# Altium schematic sheet Mobile_device_sheet3_pin_map.SchDoc
size A4; SheetNumber: 2; SheetTotal: 5
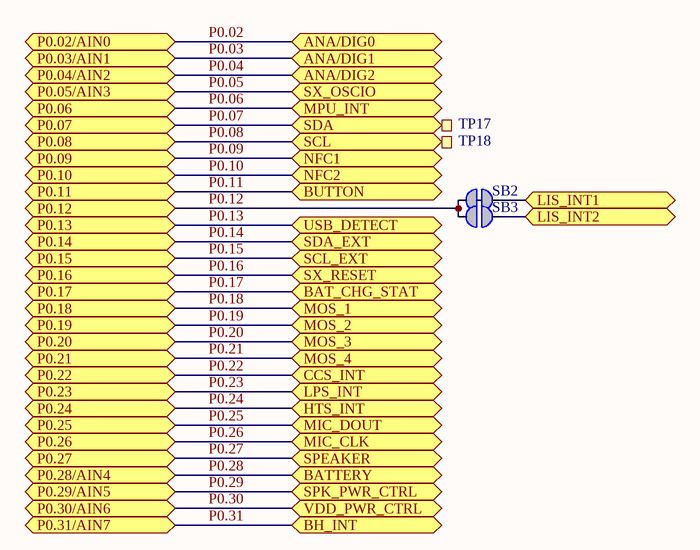
[diagram p0: Mobile_device_sheet3_pin_map.SchDoc]

## Parts
SB2  Solderbridge  [Solderbridge_Shorted]  (value not drawn)  (net tie, no BOM)
SB3  Solderbridge  [Solderbridge]  (value not drawn)  (no BOM)
TP17  Ø1.5mm,SMD  [TP_SMD_Ø1.5mm]  (value not drawn)  (no BOM)
TP18  Ø1.5mm,SMD  [TP_SMD_Ø1.5mm]  (value not drawn)  (no BOM)

## Ports
ANA/DIG0 (bidir), ANA/DIG1 (bidir), ANA/DIG2 (bidir), BAT_CHG_STAT (bidir), BATTERY (bidir), BH_INT (bidir), BUTTON (bidir), CCS_INT (bidir), HTS_INT (bidir), LIS_INT1 (bidir), LIS_INT2 (bidir), LPS_INT (bidir), MIC_CLK (bidir), MIC_DOUT (bidir), MOS_1 (bidir), MOS_2 (bidir), MOS_3 (bidir), MOS_4 (bidir), MPU_INT (bidir), NFC1 (bidir), NFC2 (bidir), P0.02/AIN0 (bidir), P0.03/AIN1 (bidir), P0.04/AIN2 (bidir), P0.05/AIN3 (bidir), P0.06 (bidir), P0.07 (bidir), P0.08 (bidir), P0.09 (bidir), P0.10 (bidir), P0.11 (bidir), P0.12 (bidir), P0.13 (bidir), P0.14 (bidir), P0.15 (bidir), P0.16 (bidir), P0.17 (bidir), P0.18 (bidir), P0.19 (bidir), P0.20 (bidir), P0.21 (bidir), P0.22 (bidir), P0.23 (bidir), P0.24 (bidir), P0.25 (bidir), P0.26 (bidir), P0.27 (bidir), P0.28/AIN4 (bidir), P0.29/AIN5 (bidir), P0.30/AIN6 (bidir), P0.31/AIN7 (bidir), SCL (bidir), SCL_EXT (bidir), SDA (bidir), SDA_EXT (bidir), SPEAKER (bidir), SPK_PWR_CTRL (bidir), SX_OSCIO (bidir), SX_RESET (bidir), USB_DETECT (bidir), VDD_PWR_CTRL (bidir)

## Nets
LIS_INT1: SB2.1 ; port LIS_INT1
LIS_INT2: SB3.1 ; port LIS_INT2
P0.02: port P0.02/AIN0, port ANA/DIG0
P0.03: port P0.03/AIN1, port ANA/DIG1
P0.04: port P0.04/AIN2, port ANA/DIG2
P0.05: port P0.05/AIN3, port SX_OSCIO
P0.06: port MPU_INT, port P0.06
P0.07: TP17.1 ; port SDA, port P0.07
P0.08: TP18.1 ; port SCL, port P0.08
P0.09: port NFC1, port P0.09
P0.10: port NFC2, port P0.10
P0.11: port P0.11, port BUTTON
P0.12: SB2.2 SB3.2 ; port P0.12
P0.13: port P0.13, port USB_DETECT
P0.14: port P0.14, port SDA_EXT
P0.15: port P0.15, port SCL_EXT
P0.16: port P0.16, port SX_RESET
P0.17: port P0.17, port BAT_CHG_STAT
P0.18: port MOS_1, port P0.18
P0.19: port MOS_2, port P0.19
P0.20: port MOS_3, port P0.20
P0.21: port MOS_4, port P0.21
P0.22: port P0.22, port CCS_INT
P0.23: port LPS_INT, port P0.23
P0.24: port P0.24, port HTS_INT
P0.25: port MIC_DOUT, port P0.25
P0.26: port MIC_CLK, port P0.26
P0.27: port SPEAKER, port P0.27
P0.28: port BATTERY, port P0.28/AIN4
P0.29: port P0.29/AIN5, port SPK_PWR_CTRL
P0.30: port P0.30/AIN6, port VDD_PWR_CTRL
P0.31: port P0.31/AIN7, port BH_INT

## Library data of the parts
SB2 = Solderbridge Shorted: Shorted Solderbridge; Artikkelnr Noca: N.A.; Part Number: Solderbridge Shorted; Manufacturer: *; Manufacturer Part Number: *; Footprint Doc: Solderbridge_Shorted; LatestRevisionDate: 2012-08-07; Pin Count: 2; Publisher: Nordic Semiconductor; Published: 2012-08-07; Value: Solderbridge; Note: *; Part number IPS: N.A.; ComponentLink1URL: *; ComponentLink1Description: Datasheet; ComponentLink2URL: *; ComponentLink2Description: Supplier link; HelpURL: *; Supplier 1: *; Supplier Part Number 1: *; Supplier 2: *; Supplier Part Number 2: *
SB3 = Solderbridge: Artikkelnr Noca: N.A.; Part Number: Solderbridge; Manufacturer: *; Manufacturer Part Number: *; Footprint Doc: Solderbridge; LatestRevisionDate: 2009-12-14; Pin Count: 2; Publisher: Nordic Semiconductor; Published: 2009-12-14; Value: Solderbridge; Note: *; Part number IPS: N.A.; ComponentLink1URL: *; ComponentLink1Description: Datasheet; ComponentLink2URL: *; ComponentLink2Description: Supplier link; HelpURL: *; Supplier 1: *; Supplier Part Number 1: *; Supplier 2: *; Supplier Part Number 2: *
TP17 TP18 = TP_SMD_Ø1.5MM: 1.0mm circular SMD testpad; Manufacturer: Nordic Semiconductor; Artikkelnr Noca: N.A.; Part Number: TP_SMD_Ø1.5MM; Manufacturer Part Number: *; Footprint Doc: TP_SMD_Ø1.5mm; LatestRevisionDate: 2016-06-02; Pin Count: 1; Publisher: Nordic Semiconductor; Published: 2016-06-02; Value: Ø1.5mm,SMD; Note: *; Part number IPS: N.A.; ComponentLink1URL: *; ComponentLink1Description: Datasheet; ComponentLink2URL: *; ComponentLink2Description: Supplier link; HelpURL: *; Supplier 1: *; Supplier Part Number 1: *; Supplier 2: *; Supplier Part Number 2: *